# EAGLE design Kintex7_ssram (EAGLE 7.6.0)
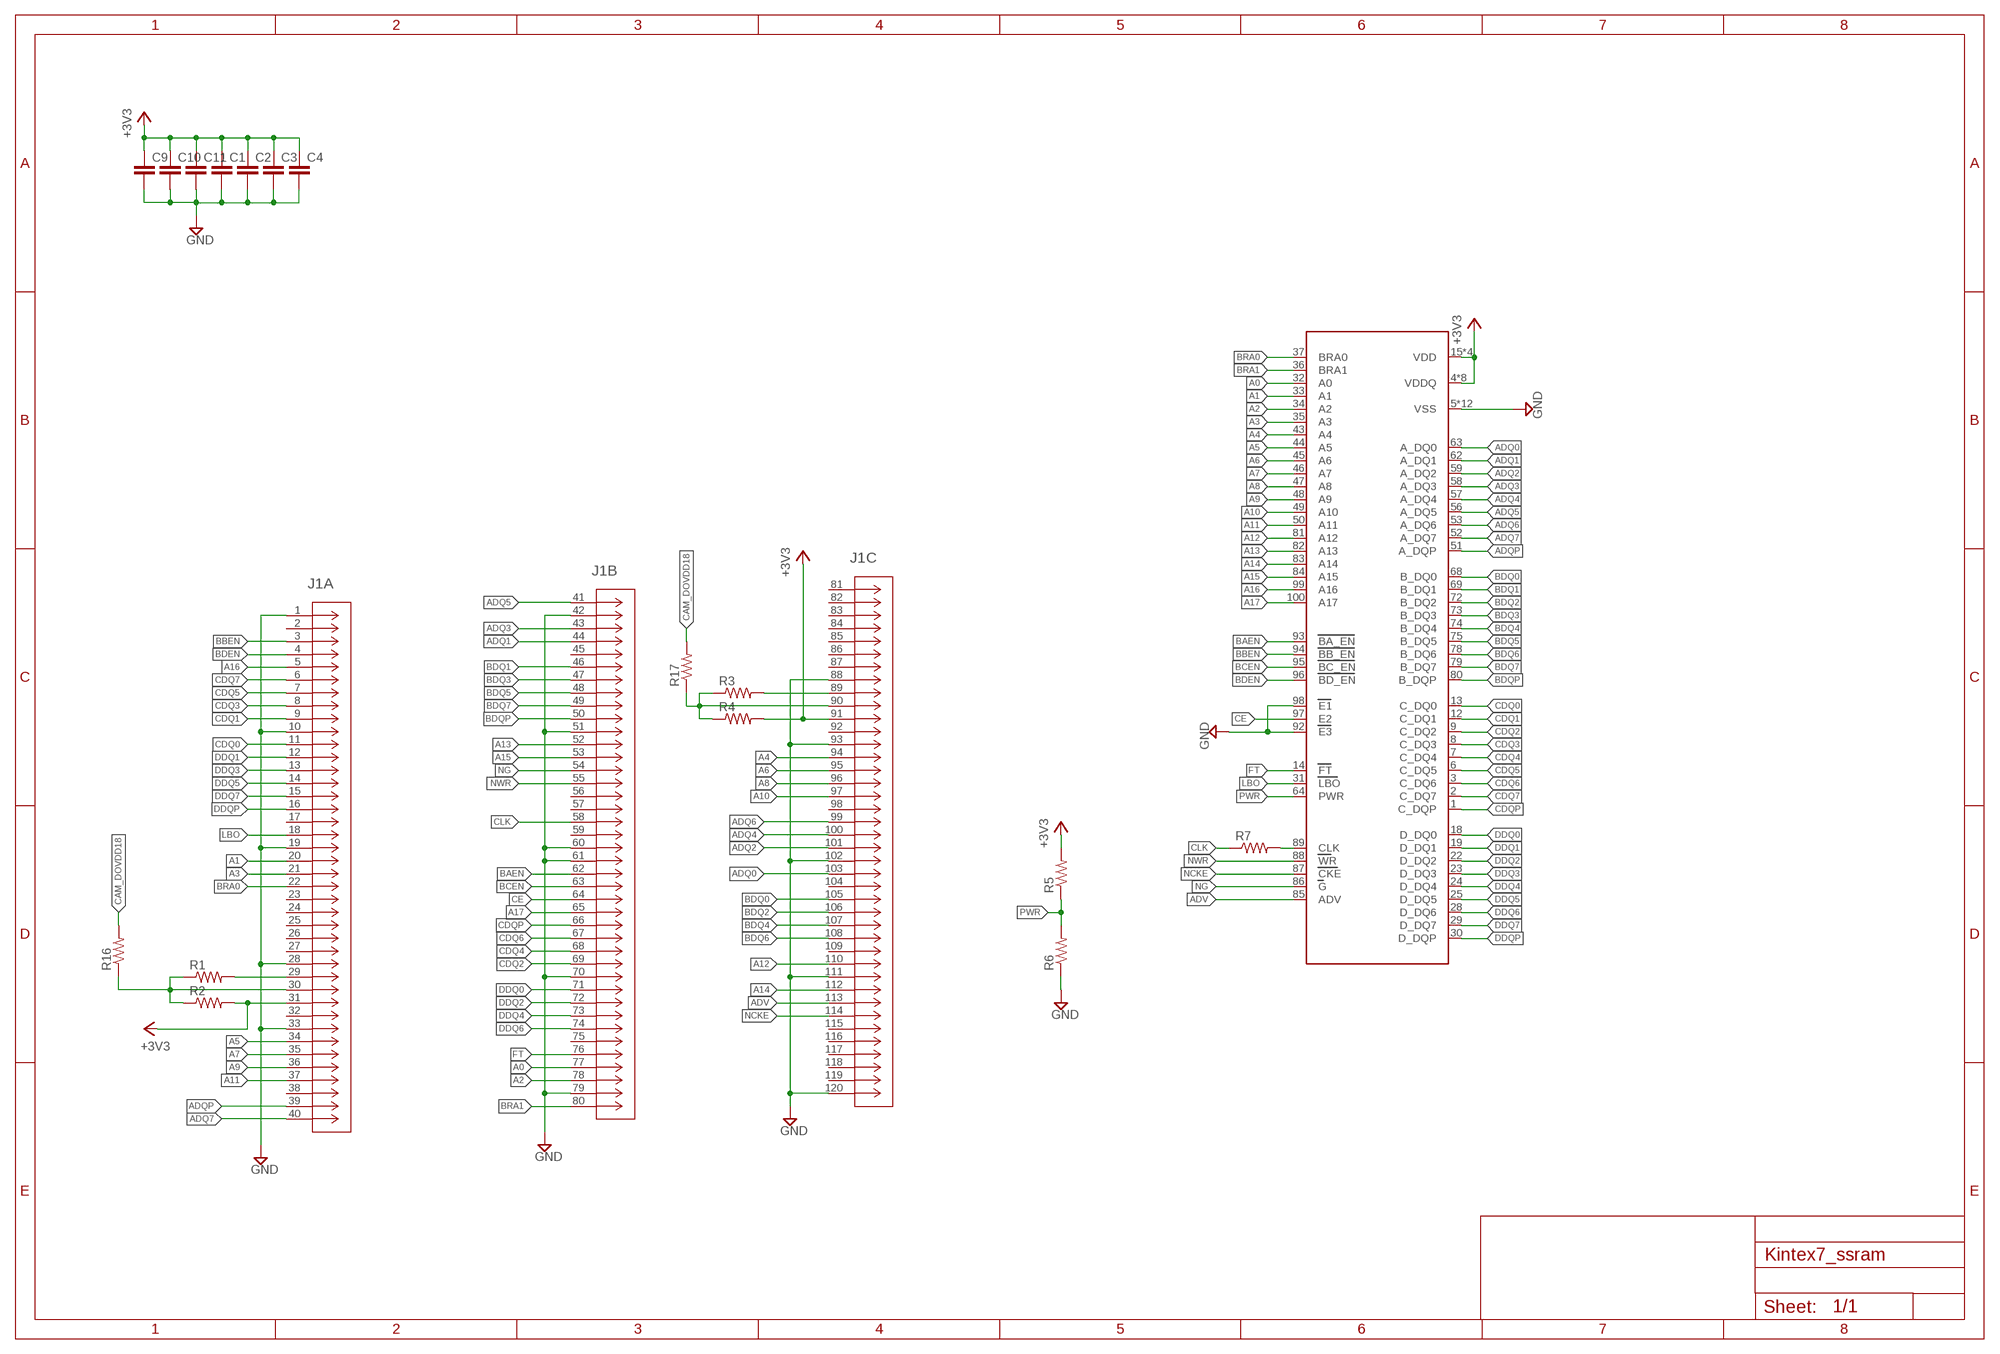
[diagram p0: schematic, sheet 1]

## Parts
C1  C-EUC0603  [C0603]
C2  C-EUC0603  [C0603]
C3  C-EUC0603  [C0603]
C4  C-EUC0603  [C0603]
C9  C-EUC0603  [C0603]
C10  C-EUC0603  [C0603]
C11  C-EUC0603  [C0603]
J1  5177985-5  [CONN_5177985-5]
R1  R-US_R0805  [R0805]
R2  R-US_R0805  [R0805]
R3  R-US_R0805  [R0805]
R4  R-US_R0805  [R0805]
R5  R-US_R0603  [R0603]
R6  R-US_R0603  [R0603]
R7  R-US_R0603  [R0603]
R16  R-US_R0805  [R0805]
R17  R-US_R0805  [R0805]
RAM  GS8320Z36GTSMT  [TQFP100-R]

## Nets
+3V3: C1.1 C2.1 C3.1 C4.1 C9.1 C10.1 C11.1 J1.31 J1.91 R2.2 R4.2 R5.2 RAM.4(VDDQ) RAM.11(VDDQ) RAM.15(VDD) RAM.20(VDDQ) RAM.27(VDDQ) RAM.41(VDD) RAM.54(VDDQ) RAM.61(VDDQ) RAM.65(VDD) RAM.70(VDDQ) RAM.77(VDDQ) RAM.91(VDD)
A0: J1.77 RAM.32(A0)
A1: J1.20 RAM.33(A1)
A2: J1.78 RAM.34(A2)
A3: J1.21 RAM.35(A3)
A4: J1.94 RAM.43(A4)
A5: J1.34 RAM.44(A5)
A6: J1.95 RAM.45(A6)
A7: J1.35 RAM.46(A7)
A8: J1.96 RAM.47(A8)
A9: J1.36 RAM.48(A9)
A10: J1.97 RAM.49(A10)
A11: J1.37 RAM.50(A11)
A12: J1.110 RAM.81(A12)
A13: J1.52 RAM.82(A13)
A14: J1.112 RAM.83(A14)
A15: J1.53 RAM.84(A15)
A16: J1.5 RAM.99(A16)
A17: J1.65 RAM.100(A17)
ADQ0: J1.103 RAM.63(A_DQ0)
ADQ1: J1.44 RAM.62(A_DQ1)
ADQ2: J1.101 RAM.59(A_DQ2)
ADQ3: J1.43 RAM.58(A_DQ3)
ADQ4: J1.100 RAM.57(A_DQ4)
ADQ5: J1.41 RAM.56(A_DQ5)
ADQ6: J1.99 RAM.53(A_DQ6)
ADQ7: J1.40 RAM.52(A_DQ7)
ADQP: J1.39 RAM.51(A_DQP)
ADV: J1.113 RAM.85(ADV)
BAEN: J1.62 RAM.93(BA_EN)
BBEN: J1.3 RAM.94(BB_EN)
BCEN: J1.63 RAM.95(BC_EN)
BDEN: J1.4 RAM.96(BD_EN)
BDQ0: J1.105 RAM.68(B_DQ0)
BDQ1: J1.46 RAM.69(B_DQ1)
BDQ2: J1.106 RAM.72(B_DQ2)
BDQ3: J1.47 RAM.73(B_DQ3)
BDQ4: J1.107 RAM.74(B_DQ4)
BDQ5: J1.48 RAM.75(B_DQ5)
BDQ6: J1.108 RAM.78(B_DQ6)
BDQ7: J1.49 RAM.79(B_DQ7)
BDQP: J1.50 RAM.80(B_DQP)
BRA0: J1.22 RAM.37(BRA0)
BRA1: J1.80 RAM.36(BRA1)
CAM_DOVDD18: R16.2 R17.2
CDQ0: J1.11 RAM.13(C_DQ0)
CDQ1: J1.9 RAM.12(C_DQ1)
CDQ2: J1.69 RAM.9(C_DQ2)
CDQ3: J1.8 RAM.8(C_DQ3)
CDQ4: J1.68 RAM.7(C_DQ4)
CDQ5: J1.7 RAM.6(C_DQ5)
CDQ6: J1.67 RAM.3(C_DQ6)
CDQ7: J1.6 RAM.2(C_DQ7)
CDQP: J1.66 RAM.1(C_DQP)
CE: J1.64 RAM.97(E2)
CLK: J1.58 R7.1
DDQ0: J1.71 RAM.18(D_DQ0)
DDQ1: J1.12 RAM.19(D_DQ1)
DDQ2: J1.72 RAM.22(D_DQ2)
DDQ3: J1.13 RAM.23(D_DQ3)
DDQ4: J1.73 RAM.24(D_DQ4)
DDQ5: J1.14 RAM.25(D_DQ5)
DDQ6: J1.74 RAM.28(D_DQ6)
DDQ7: J1.15 RAM.29(D_DQ7)
DDQP: J1.16 RAM.30(D_DQP)
FT: J1.76 RAM.14(FT)
GND: C1.2 C2.2 C3.2 C4.2 C9.2 C10.2 C11.2 J1.1 J1.10 J1.19 J1.28 J1.33 J1.42 J1.51 J1.60 J1.61 J1.70 J1.79 J1.88 J1.93 J1.102 J1.111 J1.120 R6.1 RAM.5(VSS) RAM.10(VSS) RAM.17(VSS) RAM.21(VSS) RAM.26(VSS) RAM.40(VSS) RAM.55(VSS) RAM.60(VSS) RAM.67(VSS) RAM.71(VSS) RAM.76(VSS) RAM.90(VSS) RAM.92(E3) RAM.98(E1)
LBO: J1.18 RAM.31(LBO)
N$1: R7.2 RAM.89(CLK)
N$2: J1.90 R3.1 R4.1 R17.1
N$3: J1.29 R1.2
N$4: J1.89 R3.2
N$9: J1.30 R1.1 R2.1 R16.1
NCKE: J1.114 RAM.87(CKE)
NG: J1.54 RAM.86(G)
NWR: J1.55 RAM.88(WR)
PWR: R5.1 R6.2 RAM.64(PWR)
Unconnected: J1.2 J1.17 J1.23 J1.24 J1.25 J1.26 J1.27 J1.32 J1.38 J1.45 J1.56 J1.57 J1.59 J1.75 J1.81 J1.82 J1.83 J1.84 J1.85 J1.86 J1.87 J1.92 J1.98 J1.104 J1.109 J1.115 J1.116 J1.117 J1.118 J1.119

## Library data of the parts
C1-C4 C9-C11 = resistor:C-EU: CAPACITOR, European symbol
J1 = te_con:5177985-5; BUILT_BY: EMA_UL_Team; MANUFACTURER_PART_NUMBER: 5177985-5; VENDOR: TE Connectivity
R1-R7 R16 R17 = rcl:R-US_: RESISTOR, American symbol
RAM = 2ref-packages-longpad:GS8320Z36GT

## Board
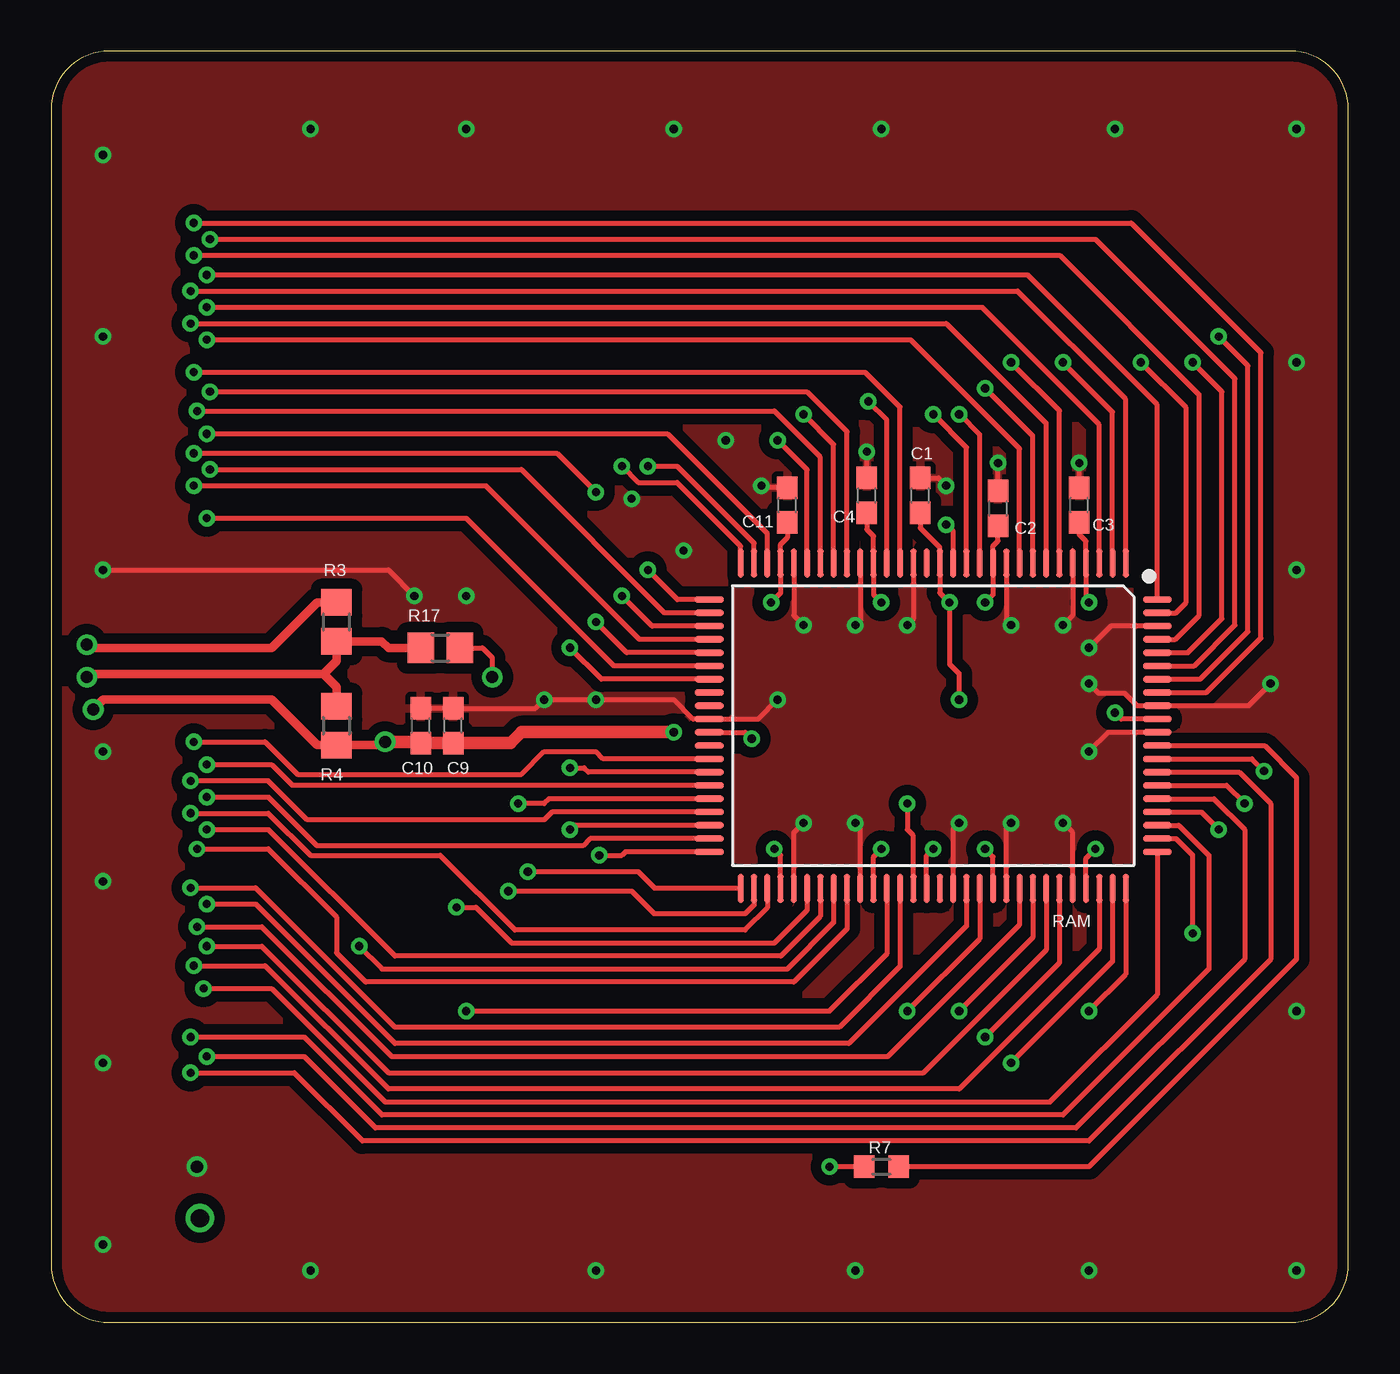
[diagram p1: board, top side]
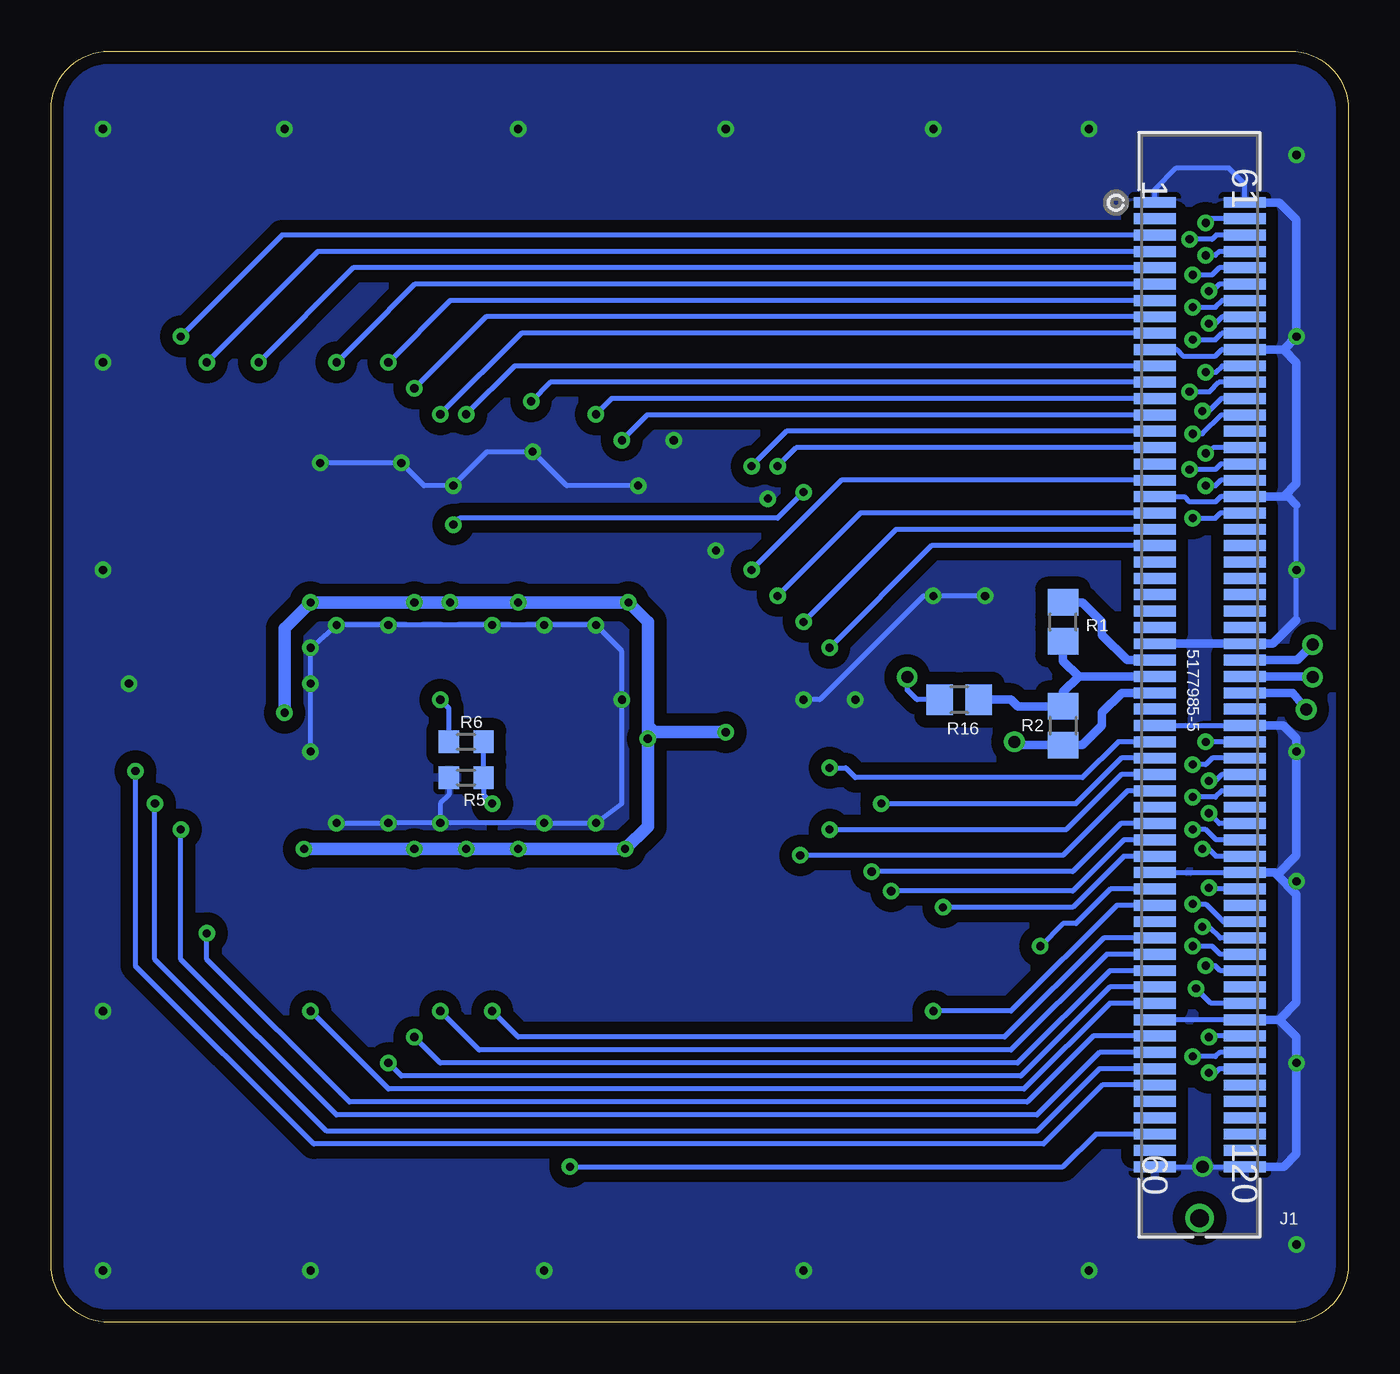
[diagram p2: board, bottom side, seen from below]

Size 63.5 x 62.23 mm. Coordinates in mm from the lower left corner, seen from the top.
Outline: 0,59.39 0,2.84 arc90 2.84,0 60.66,0 arc90 63.5,2.84 63.5,59.39 arc90 60.66,62.23 2.84,62.23 arc90 0,59.39
Copper layers (1*16): Top 0.035mm / dielectric 1.5mm / Bottom 0.035mm
Design rules "2side *": minimum track width 6mil, minimum drill 0.4mm, track to track 7mil, track to pad 7mil, pad to pad 7mil, via to via 7mil, smd to smd 7mil, copper to edge 10mil, drill to drill 10mil, minimum pad ring 10mil, minimum via ring 8mil, stop-mask expansion 1mil, vias tented up to drill 0.8mm, thermal gap 10mil

### Footprints (pad centres in the part's own frame; a part is rotated, then mirrored left to right if it is on the bottom)
C0603 = smd 1.1 x 1: 1 -0.85,0; 2 0.85,0
CONN_5177985-5 = smd 0.533 x 2.057: 1 -47.2,-4.4; 2 -46.4,-4.4; 3 -45.6,-4.4; 4 -44.8,-4.4; 5 -44,-4.4; 6 -43.2,-4.4; 7 -42.4,-4.4; 8 -41.6,-4.4; 9 -40.8,-4.4; 10 -40,-4.4; 11 -39.2,-4.4; 12 -38.4,-4.4; 13 -37.6,-4.4; 14 -36.8,-4.4; 15 -36,-4.4; 16 -35.2,-4.4; 17 -34.4,-4.4; 18 -33.6,-4.4; 19 -32.8,-4.4; 20 -32,-4.4; 21 -31.2,-4.4; 22 -30.4,-4.4; 23 -29.6,-4.4; 24 -28.8,-4.4; 25 -28,-4.4; 26 -27.2,-4.4; 27 -26.4,-4.4; 28 -25.6,-4.4; 29 -24.8,-4.4; 30 -24,-4.4; 31 -23.2,-4.4; 32 -22.4,-4.4; 33 -21.6,-4.4; 34 -20.8,-4.4; 35 -20,-4.4; 36 -19.2,-4.4; 37 -18.4,-4.4; 38 -17.6,-4.4; 39 -16.8,-4.4; 40 -16,-4.4; 41 -15.2,-4.4; 42 -14.4,-4.4; 43 -13.6,-4.4; 44 -12.8,-4.4; 45 -12,-4.4; 46 -11.2,-4.4; 47 -10.4,-4.4; 48 -9.6,-4.4; 49 -8.8,-4.4; 50 -8,-4.4; 51 -7.2,-4.4; 52 -6.4,-4.4; 53 -5.6,-4.4; 54 -4.8,-4.4; 55 -4,-4.4; 56 -3.2,-4.4; 57 -2.4,-4.4; 58 -1.6,-4.4; 59 -0.8,-4.4; 60 0,-4.4; 61 -47.2,0; 62 -46.4,0; 63 -45.6,0; 64 -44.8,0; 65 -44,0; 66 -43.2,0; 67 -42.4,0; 68 -41.6,0; 69 -40.8,0; 70 -40,0; 71 -39.2,0; 72 -38.4,0; 73 -37.6,0; 74 -36.8,0; 75 -36,0; 76 -35.2,0; 77 -34.4,0; 78 -33.6,0; 79 -32.8,0; 80 -32,0; 81 -31.2,0; 82 -30.4,0; 83 -29.6,0; 84 -28.8,0; 85 -28,0; 86 -27.2,0; 87 -26.4,0; 88 -25.6,0; 89 -24.8,0; 90 -24,0; 91 -23.2,0; 92 -22.4,0; 93 -21.6,0; 94 -20.8,0; 95 -20,0; 96 -19.2,0; 97 -18.4,0; 98 -17.6,0; 99 -16.8,0; 100 -16,0; 101 -15.2,0; 102 -14.4,0; 103 -13.6,0; 104 -12.8,0; 105 -12,0; 106 -11.2,0; 107 -10.4,0; 108 -9.6,0; 109 -8.8,0; 110 -8,0; 111 -7.2,0; 112 -6.4,0; 113 -5.6,0; 114 -4.8,0; 115 -4,0; 116 -3.2,0; 117 -2.4,0; 118 -1.6,0; 119 -0.8,0; 120 0,0 | drill 0.889 pad 0.889: 121 2.515,-2.21
R0805 = smd 1.3 x 1.5: 1 -0.95,0; 2 0.95,0
R0603 = smd 1 x 1.1: 1 -0.85,0; 2 0.85,0
TQFP100-R = smd 0.3 x 1.4: 1 -9.425,-7.963; 2 -8.775,-7.963; 3 -8.125,-7.963; 4 -7.475,-7.963; 5 -6.825,-7.963; 6 -6.175,-7.963; 7 -5.525,-7.963; 8 -4.875,-7.963; 9 -4.225,-7.963; 10 -3.575,-7.963; 11 -2.925,-7.963; 12 -2.275,-7.963; 13 -1.625,-7.963; 14 -0.975,-7.963; 15 -0.325,-7.963; 16 0.325,-7.963; 17 0.975,-7.963; 18 1.625,-7.963; 19 2.275,-7.963; 20 2.925,-7.963; 21 3.575,-7.963; 22 4.225,-7.963; 23 4.875,-7.963; 24 5.525,-7.963; 25 6.175,-7.963; 26 6.825,-7.963; 27 7.475,-7.963; 28 8.125,-7.963; 29 8.775,-7.963; 30 9.425,-7.963; 51 9.425,7.963; 52 8.775,7.963; 53 8.125,7.963; 54 7.475,7.963; 55 6.825,7.963; 56 6.175,7.963; 57 5.525,7.963; 58 4.875,7.963; 59 4.225,7.963; 60 3.575,7.963; 61 2.925,7.963; 62 2.275,7.963; 63 1.625,7.963; 64 0.975,7.963; 65 0.325,7.963; 66 -0.325,7.963; 67 -0.975,7.963; 68 -1.625,7.963; 69 -2.275,7.963; 70 -2.925,7.963; 71 -3.575,7.963; 72 -4.225,7.963; 73 -4.875,7.963; 74 -5.525,7.963; 75 -6.175,7.963; 76 -6.825,7.963; 77 -7.475,7.963; 78 -8.125,7.963; 79 -8.775,7.963; 80 -9.425,7.963 | smd 1.4 x 0.3: 31 10.963,-6.175; 32 10.963,-5.525; 33 10.963,-4.875; 34 10.963,-4.225; 35 10.963,-3.575; 36 10.963,-2.925; 37 10.963,-2.275; 38 10.963,-1.625; 39 10.963,-0.975; 40 10.963,-0.325; 41 10.963,0.325; 42 10.963,0.975; 43 10.963,1.625; 44 10.963,2.275; 45 10.963,2.925; 46 10.963,3.575; 47 10.963,4.225; 48 10.963,4.875; 49 10.963,5.525; 50 10.963,6.175; 81 -10.963,6.175; 82 -10.963,5.525; 83 -10.963,4.875; 84 -10.963,4.225; 85 -10.963,3.575; 86 -10.963,2.925; 87 -10.963,2.275; 88 -10.963,1.625; 89 -10.963,0.975; 90 -10.963,0.325; 91 -10.963,-0.325; 92 -10.963,-0.975; 93 -10.963,-1.625; 94 -10.963,-2.275; 95 -10.963,-2.925; 96 -10.963,-3.575; 97 -10.963,-4.225; 98 -10.963,-4.875; 99 -10.963,-5.525; 100 -10.963,-6.175

### Placement (x,y rotation side)
C1  42.54,40.48 90 top
C2  46.35,39.85 90 top
C3  50.32,40.01 90 top
C4  39.93,40.48 90 top
C9  19.68,29.21 90 top
C10  18.1,29.21 90 top
C11  36.04,40.01 90 top
J1  5.08,7.62 270 bottom
R1  13.97,34.29 90 bottom
R2  13.97,29.21 270 bottom
R3  13.97,34.29 90 top
R4  13.97,29.21 270 top
R5  43.18,28.42 180 bottom
R6  43.18,26.67 0 bottom
R7  40.64,7.62 0 top
R16  19.05,30.48 180 bottom
R17  19.05,33.02 0 top
RAM  43.18,29.21 180 top

### Tracks (layer width: path | path; a pad name or v marks a point on that pad's centre or on a via)
+3V3  (via drill 0.4, 0.6)
  Top 0.254: C1.1 42.54,38.89 43.5,37.93 RAM.15 43.5,35.71 v43.97,35.24 43.97,32.23 44.45,31.75 v44.45,30.48 | v45.72,35.24 46.1,35.63 RAM.11 46.1,38.01 46.35,38.26 C2.1 | v50.8,35.24 50.65,35.39 RAM.4 50.65,38.24 50.32,38.58 C3.1 | v35.24,35.24 35.7,35.7 RAM.27 35.7,38.09 36.04,38.42 C11.1 | v40.64,35.24 40.25,35.63 RAM.20 40.25,38.48 39.93,38.81 C4.1 | RAM.91 52.38,29.54 v52.07,29.84 | RAM.41 33.98,28.89 v34.29,28.57 | RAM.77 50.65,22.71 v51.12,23.18 | RAM.61 40.25,22.79 v40.64,23.18 | RAM.70 46.1,22.79 v45.72,23.18 | RAM.65 42.85,22.85 v43.18,23.18 | RAM.54 35.7,22.87 v35.4,23.18 | 18.04,28.42 C10.1
  Top 0.406: v2.06,30 2.54,30.48 10.79,30.48 13.02,28.26 R2.2 16.19,28.26 v16.35,28.42
  Top 0.61: v16.35,28.42 18.04,28.42 | C10.1 C9.1 22.49,28.36 23.02,28.89 v30.48,28.89
  Bottom 0.254: R5.2 44.03,30.06 v44.45,30.48
  Bottom 0.406: J1.91 2.72,30.82 v2.06,30 | J1.31 11.09,30.82 12.07,29.84 12.07,29.21 13.02,28.26 R2.2 16.19,28.26 v16.35,28.42
  Bottom 0.61: v52.07,29.84 52.07,33.97 v50.8,35.24 v45.72,35.24 v43.97,35.24 v40.64,35.24 v35.24,35.24 34.29,34.29 34.29,29.21 | 34.29,29.21 v34.29,28.57 34.29,24.29 v35.4,23.18 v40.64,23.18 v43.18,23.18 v45.72,23.18 v51.12,23.18 | v30.48,28.89 33.97,28.89 34.29,29.21
A0  (via drill 0.4)
  Top 0.254: RAM.32 30.04,34.73 23.02,41.75 v7.78,41.75
  Bottom 0.254: J1.77 6.24,42.02 6.51,41.75 v7.78,41.75
A1  (via drill 0.4)
  Top 0.254: RAM.33 29.41,34.09 v27.94,35.56
  Bottom 0.254: J1.20 23.88,39.62 v27.94,35.56
A2  (via drill 0.4)
  Top 0.254: RAM.34 28.8,33.44 21.27,40.96 v6.99,40.96
  Bottom 0.254: J1.78 6.25,41.22 6.51,40.96 v6.99,40.96
A3  (via drill 0.4)
  Top 0.254: RAM.35 28.18,32.78 v26.67,34.29
  Bottom 0.254: J1.21 22.14,38.82 v26.67,34.29
A4  (via drill 0.4)
  Top 0.254: v6.99,28.42 10.48,28.42 12.07,26.83 23.02,26.83 24.13,27.94 26.67,27.94 27.03,27.59 RAM.43
  Bottom 0.254: J1.94 v6.98,28.42 v6.99,28.42
A5  (via drill 0.4)
  Top 0.254: RAM.44 26.3,26.93 26.09,27.15 v25.4,27.15
  Bottom 0.254: J1.34 11.27,28.42 13.02,26.67 24.13,26.67 24.61,27.15 v25.4,27.15
A6  (via drill 0.4)
  Top 0.254: v7.62,27.3 10.79,27.3 11.82,26.29 RAM.45
  Bottom 0.254: J1.95 6.67,27.62 6.99,27.3 v7.62,27.3
A7  (via drill 0.4)
  Top 0.254: RAM.46 24.37,25.64 24.13,25.4 v22.86,25.4
  Bottom 0.254: J1.35 11.12,27.62 13.34,25.4 v22.86,25.4
A8  (via drill 0.4)
  Top 0.254: RAM.47 24.51,24.98 24.13,24.61 12.54,24.61 10.64,26.51 v6.83,26.51
  Bottom 0.254: v6.83,26.51 6.51,26.51 6.2,26.82 J1.96
A9  (via drill 0.4)
  Top 0.254: RAM.48 25.61,24.34 v25.4,24.13
  Bottom 0.254: J1.36 11.12,26.82 13.81,24.13 v25.4,24.13
A10  (via drill 0.4)
  Top 0.254: 7.94,25.72 v7.62,25.72 10.64,25.72 13.02,23.34 26.04,23.34 26.38,23.68 RAM.49
  Bottom 0.254: J1.97 6.21,26.02 6.51,25.72 v7.62,25.72
A11  (via drill 0.4)
  Top 0.254: v26.83,22.86 27.94,22.86 28.12,23.04 RAM.50
  Bottom 0.254: J1.37 10.81,26.02 13.97,22.86 v26.83,22.86
A12  (via drill 0.4)
  Top 0.254: v7.46,16.35 10.79,16.35 16.35,10.79 48.89,10.79 54.14,16.04 RAM.81
  Bottom 0.254: J1.110 6.73,15.62 v7.46,16.35
A13  (via drill 0.4)
  Top 0.254: v55.88,19.05 55.88,22.86 55.05,23.68 RAM.82
  Bottom 0.254: J1.52 12.49,14.02 15.72,10.79 48.89,10.79 55.88,17.78 v55.88,19.05
A14  (via drill 0.4)
  Top 0.254: RAM.83 55.2,24.34 56.67,22.86 56.67,17.3 49.53,10.16 16.19,10.16 12.38,13.97 v6.83,13.97
  Bottom 0.254: J1.112 6.62,14.02 v6.83,13.97
A15  (via drill 0.4)
  Top 0.254: v57.15,24.13 56.29,24.98 RAM.84
  Bottom 0.254: J1.53 12.18,13.22 15.24,10.16 49.53,10.16 57.15,17.78 v57.15,24.13
A16  (via drill 0.4)
  Top 0.254: RAM.99 55.05,34.73 55.56,35.24 55.56,44.77 v53.34,46.99
  Bottom 0.254: v53.34,46.99 48.71,51.62 J1.5
A17  (via drill 0.4)
  Top 0.254: RAM.100 54.14,44.92 47.78,51.28 v7.62,51.28
  Bottom 0.254: v7.62,51.28 6.67,51.28 6.32,51.62 J1.65
ADQ0  (via drill 0.4)
  Top 0.254: v6.83,21.27 10,21.27 16.83,14.45 38.58,14.45 41.55,17.43 RAM.63
  Bottom 0.254: J1.103 6.77,21.22 v6.83,21.27
ADQ1  (via drill 0.4)
  Top 0.254: v20.32,15.24 38.1,15.24 40.9,18.05 RAM.62
  Bottom 0.254: J1.44 11.33,20.42 16.51,15.24 v20.32,15.24
ADQ2  (via drill 0.4)
  Top 0.254: RAM.59 38.95,19.27 36.35,16.67 15.4,16.67 13.97,18.1 13.97,19.84 10.64,23.18 v7.14,23.18
  Bottom 0.254: v7.14,23.18 6.83,23.18 6.47,22.82 J1.101
ADQ3  (via drill 0.4)
  Top 0.254: RAM.58 38.3,19.57 36.04,17.3 16.19,17.3 v15.08,18.41
  Bottom 0.254: J1.43 11.64,21.22 13.34,19.53 13.97,19.53 v15.08,18.41
ADQ4  (via drill 0.4)
  Top 0.254: v7.62,24.13 10.64,24.13 16.83,17.94 35.72,17.94 37.65,19.88 RAM.57
  Bottom 0.254: J1.100 6.47,23.62 6.99,24.13 v7.62,24.13
ADQ5  (via drill 0.4)
  Top 0.254: RAM.56 37,20.18 35.4,18.57 22.54,18.57 20.8,20.32 v19.84,20.32
  Bottom 0.254: J1.41 10.99,22.82 13.49,20.32 v19.84,20.32
ADQ6  (via drill 0.4)
  Top 0.254: v6.83,24.92 10.64,24.92 12.7,22.86 19.05,22.86 22.7,19.21 33.97,19.21 35.05,20.29 RAM.53
  Bottom 0.254: J1.99 6.32,24.42 v6.83,24.92
ADQ7  (via drill 0.4)
  Top 0.254: v22.38,21.11 28.42,21.11 29.53,20 33.97,20 34.4,20.43 RAM.52
  Bottom 0.254: J1.40 10.99,23.62 13.49,21.11 v22.38,21.11
ADQP  (via drill 0.4)
  Top 0.254: v23.34,22.07 28.73,22.07 29.55,21.25 RAM.51
  Bottom 0.254: J1.39 11.14,24.42 13.49,22.07 v23.34,22.07
ADV  (via drill 0.4)
  Top 0.254: RAM.85 56.91,25.64 58.42,24.13 58.42,17.78 50.16,9.53 15.88,9.53 12.38,13.02 v7.62,13.02
  Bottom 0.254: J1.113 6.31,13.22 6.51,13.02 v7.62,13.02
BAEN  (via drill 0.4)
  Top 0.254: RAM.93 56.55,30.84 59.21,33.5 59.21,47.47 52.86,53.82 v6.99,53.82
  Bottom 0.254: J1.62 6.78,54.02 v6.99,53.82
BBEN  (via drill 0.4)
  Top 0.254: RAM.94 56.25,31.48 58.58,33.81 58.58,46.83 v57.15,48.26
  Bottom 0.254: v57.15,48.26 52.19,53.22 J1.3
BCEN  (via drill 0.4)
  Top 0.254: RAM.95 55.95,32.13 57.94,34.13 57.94,46.2 52.7,51.44 52.39,51.75 51.12,53.02 v7.78,53.02
  Bottom 0.254: J1.63 6.47,53.22 6.67,53.02 v7.78,53.02
BDEN  (via drill 0.4)
  Top 0.254: RAM.96 55.64,32.78 57.31,34.45 57.31,45.56 v55.88,46.99
  Bottom 0.254: v55.88,46.99 50.45,52.42 J1.4
BDQ0  (via drill 0.4)
  Top 0.254: v7.62,20.48 10,20.48 16.83,13.65 39.05,13.65 44.8,19.41 RAM.68
  Bottom 0.254: v7.62,20.48 6.99,20.48 6.13,19.62 J1.105
BDQ1  (via drill 0.4)
  Top 0.254: v41.91,15.24 45.45,18.79 RAM.69
  Bottom 0.254: J1.46 11.98,18.82 16.83,13.97 40.64,13.97 v41.91,15.24
BDQ2  (via drill 0.4)
  Top 0.254: v7.14,19.37 10.32,19.37 16.67,13.02 40.96,13.02 47.4,19.46 RAM.72
  Bottom 0.254: J1.106 6.28,18.82 6.83,19.37 v7.14,19.37
BDQ3  (via drill 0.4)
  Top 0.254: RAM.73 48.05,18.84 v44.45,15.24
  Bottom 0.254: J1.47 11.83,18.02 16.51,13.34 42.54,13.34 v44.45,15.24
BDQ4  (via drill 0.4)
  Top 0.254: v7.62,18.41 10.32,18.41 16.51,12.22 42.7,12.22 48.7,18.23 RAM.74
  Bottom 0.254: J1.107 6.27,18.02 6.67,18.41 v7.62,18.41
BDQ5  (via drill 0.4)
  Top 0.254: v45.72,13.97 49.35,17.61 RAM.75
  Bottom 0.254: J1.48 11.67,17.22 16.19,12.7 44.45,12.7 v45.72,13.97
BDQ6  (via drill 0.4)
  Top 0.254: RAM.78 51.3,18.29 44.45,11.43 16.51,11.43 10.48,17.46 v6.99,17.46
  Bottom 0.254: J1.108 6.27,17.22 6.51,17.46 v6.99,17.46
BDQ7  (via drill 0.4)
  Top 0.254: RAM.79 51.95,17.66 v46.99,12.7
  Bottom 0.254: J1.49 11.68,16.42 16.03,12.06 46.35,12.06 v46.99,12.7
BDQP  (via drill 0.4)
  Top 0.254: v50.8,15.24 52.6,17.05 RAM.80
  Bottom 0.254: J1.50 11.69,15.62 15.88,11.43 46.99,11.43 v50.8,15.24
BRA0  (via drill 0.4)
  Top 0.254: RAM.37 26.93,31.48 v25.4,33.02
  Bottom 0.254: J1.22 20.4,38.02 v25.4,33.02
BRA1  (via drill 0.4)
  Top 0.254: RAM.36 27.55,32.13 20.32,39.37 v7.62,39.37
  Bottom 0.254: J1.80 6.26,39.62 6.51,39.37 v7.62,39.37
CAM_DOVDD18  (via drill 0.6)
  Top 0.254: R17.2 21.11,33.02 21.59,32.54 v21.59,31.59
  Bottom 0.254: R16.2 21.11,30.48 21.59,30.96 v21.59,31.59
CDQ0  (via drill 0.4)
  Top 0.254: v43.18,44.45 44.8,42.83 RAM.13
  Bottom 0.254: J1.11 40.81,46.82 v43.18,44.45
CDQ1  (via drill 0.4)
  Top 0.254: v44.45,44.45 45.45,43.45 RAM.12
  Bottom 0.254: J1.9 40.48,48.42 v44.45,44.45
CDQ2  (via drill 0.4)
  Top 0.254: RAM.9 47.4,42.77 42.07,48.1 v7.62,48.1
  Bottom 0.254: J1.69 6.19,48.42 6.51,48.1 v7.62,48.1
CDQ3  (via drill 0.4)
  Top 0.254: v45.72,45.72 48.05,43.38 RAM.8
  Bottom 0.254: v45.72,45.72 42.22,49.22 J1.8
CDQ4  (via drill 0.4)
  Top 0.254: RAM.7 48.7,44.01 43.81,48.9 v6.83,48.9
  Bottom 0.254: J1.68 6.18,49.22 6.51,48.9 v6.83,48.9
CDQ5  (via drill 0.4)
  Top 0.254: v46.99,46.99 49.35,44.62 RAM.6
  Bottom 0.254: v46.99,46.99 43.96,50.02 J1.7
CDQ6  (via drill 0.4)
  Top 0.254: RAM.3 51.3,43.95 45.56,49.69 v7.62,49.69
  Bottom 0.254: J1.67 6.18,50.02 6.51,49.69 v7.62,49.69
CDQ7  (via drill 0.4)
  Top 0.254: v49.53,46.99 51.95,44.56 RAM.2
  Bottom 0.254: v49.53,46.99 46.99,49.53 46.97,49.55 45.7,50.82 J1.6
CDQP  (via drill 0.4)
  Top 0.254: RAM.1 52.6,45.19 47.31,50.48 v6.83,50.48
  Bottom 0.254: J1.66 6.33,50.82 6.67,50.48 v6.83,50.48
CE  (via drill 0.4)
  Top 0.254: RAM.97 55.02,33.44 56.2,34.61 56.2,45.4 49.37,52.23 v6.99,52.23
  Bottom 0.254: J1.64 6.32,52.42 6.51,52.23 v6.99,52.23
CLK  (via drill 0.4)
  Top 0.254: R7.1 v38.1,7.62
  Bottom 0.254: v38.1,7.62 13.97,7.62 12.37,9.22 J1.58
DDQ0  (via drill 0.4)
  Top 0.254: RAM.18 41.55,44.8 39.85,46.51 v6.99,46.51
  Bottom 0.254: J1.71 6.18,46.82 6.49,46.51 v6.99,46.51
DDQ1  (via drill 0.4)
  Top 0.254: v40,45.09 40.9,44.19 RAM.19
  Bottom 0.254: J1.12 39.07,46.02 v40,45.09
DDQ2  (via drill 0.4)
  Top 0.254: RAM.22 38.95,43.59 36.99,45.56 v7.78,45.56
  Bottom 0.254: J1.72 6.33,46.02 6.79,45.56 v7.78,45.56
DDQ3  (via drill 0.4)
  Top 0.254: v36.83,44.45 38.3,42.98 RAM.23
  Bottom 0.254: J1.13 36.06,45.22 v36.83,44.45
DDQ4  (via drill 0.4)
  Top 0.254: RAM.24 37.65,42.35 35.4,44.61 v7.14,44.61
  Bottom 0.254: J1.73 6.21,45.22 6.83,44.61 v7.14,44.61
DDQ5  (via drill 0.4)
  Top 0.254: RAM.25 37,41.73 v35.56,43.18
  Bottom 0.254: J1.14 34.32,44.42 v35.56,43.18
DDQ6  (via drill 0.4)
  Top 0.254: RAM.28 35.05,38.6 30.16,43.5 v7.62,43.5
  Bottom 0.254: v7.62,43.5 7.14,43.5 6.22,44.42 J1.74
DDQ7  (via drill 0.4)
  Top 0.254: RAM.29 34.4,38.14 30.64,41.91 v29.21,41.91
  Bottom 0.254: J1.15 27.5,43.62 v29.21,41.91
DDQP  (via drill 0.4)
  Top 0.254: RAM.30 33.75,38 30.64,41.12 28.73,41.12 v27.94,41.91
  Bottom 0.254: v27.94,41.91 27.03,42.82 J1.16
FT  (via drill 0.4)
  Top 0.254: v26.67,40.64 24.77,42.55 v6.99,42.55 | RAM.14 44.15,38.71 v43.81,39.05
  Bottom 0.254: J1.76 6.62,42.82 v6.99,42.55 | v26.67,40.64 27.94,39.37 43.5,39.37 v43.81,39.05
GND  (via drill 0.4, 0.6)
  Top 0.254: RAM.17 42.2,34.43 v41.91,34.13 | RAM.21 39.6,34.37 v39.37,34.13 | RAM.26 36.35,34.61 v36.83,34.13 | RAM.10 46.75,34.37 v46.99,34.13 | RAM.98 51.86,34.09 v50.8,33.02 | RAM.5 50,34.61 v49.53,34.13 | RAM.55 36.35,23.97 v36.83,24.45 | C1.2 43.44,41.33 v43.81,40.96 | C3.2 v50.32,42.07 | RAM.90 51.74,28.89 v50.8,27.94 | v50.8,31.27 51.28,30.8 52.55,30.8 53.16,30.18 RAM.92 58.6,30.18 v59.69,31.27 | RAM.60 39.6,24.21 v39.37,24.45 | RAM.67 44.15,24.15 v44.45,24.45 | RAM.71 46.75,24.21 v46.99,24.45 | RAM.76 50,23.97 v49.53,24.45 | C2.2 v46.35,42.07 | C4.2 v39.93,42.62 | C11.2 34.87,40.85 v34.77,40.96 | v2.54,36.83 16.51,36.83 v17.78,35.56 | C10.2 C9.2 23.71,30.06 v24.13,30.48 v26.67,30.48 30.48,30.48 31.43,29.54 RAM.40 34.61,29.54 v35.56,30.48
  Bottom 0.254: J1.60 v7.14,7.62 | v7.14,7.62 | J1.61 5.08,55.72 5.87,56.52 8.41,56.52 9.48,55.45 J1.1 | J1.10 8.41,47.62 8.1,47.31 6.51,47.31 6.19,47.62 J1.70 | J1.19 8.04,40.42 7.78,40.16 6.51,40.16 6.25,40.42 J1.79 | J1.33 J1.93 | J1.42 J1.102 | v50.8,27.94 v50.8,31.27 v50.8,33.02 v49.53,34.13 v46.99,34.13 v41.91,34.13 v39.37,34.13 v36.83,34.13 35.56,32.86 v35.56,30.48 35.56,25.4 v36.83,24.45 v39.37,24.45 v44.45,24.45 | v44.45,24.45 v46.99,24.45 v49.53,24.45 | v50.32,42.07 v46.35,42.07 45.24,40.96 v43.81,40.96 42.15,42.62 v39.93,42.62 38.26,40.96 v34.77,40.96 | R6.1 44.03,25.82 44.45,25.4 v44.45,24.45 | J1.111 J1.51 | 2.54,34.37 v2.54,36.83 2.54,40.01 | v17.78,35.56 20.8,35.56 25.88,30.48 v26.67,30.48 | v7.14,7.62 J1.120
  Bottom 0.406: 3.39,14.82 2.54,13.97 2.54,8.26 3.18,7.62 J1.120 | J1.102 3.6,22.02 3.49,21.91 | 3.49,21.91 2.54,20.95 2.54,15.67 3.39,14.82 | J1.28 J1.88 3.69,33.22 2.54,34.37 | 3.49,21.91 2.54,22.86 2.54,28.57 3.19,29.22 J1.93 | J1.79 3.18,40.42 | 3.18,40.42 2.95,40.42 2.54,40.01 | J1.70 3.17,47.62 | 3.17,47.62 2.54,46.99 2.54,41.05 3.18,40.42 | J1.61 3.39,54.82 2.54,53.98 v2.54,48.25 3.17,47.62 | J1.111 3.39,14.82
  other vias: 28.42,40.32 30.96,37.78 33.02,43.18 12.7,2.54 26.67,2.54 39.37,2.54 50.8,2.54 60.96,36.83 60.96,46.99 60.96,58.42 52.07,58.42 40.64,58.42 30.48,58.42 20.32,58.42 12.7,58.42 2.54,57.15 2.54,27.94 2.54,21.59 2.54,12.7 2.54,3.81 20.32,35.56 60.96,15.24 60.96,2.54
  pour Bottom (isolate 0.61): 0,62.23 63.5,62.23 63.5,0 0,0
  pour Top (isolate 0.508): 0,62.23 63.5,62.23 63.5,0 0,0
LBO  (via drill 0.4)
  Top 0.254: RAM.31 30.66,35.38 v29.21,36.83
  Bottom 0.254: J1.18 24.82,41.22 v29.21,36.83
N$1
  Top 0.254: RAM.89 59.39,28.23 60.96,26.67 60.96,17.78 50.8,7.62 R7.2
N$2  (via drill 0.6)
  Top 0.406: 13.34,31.75 13.97,32.38 R3.1 16.19,33.34 16.51,33.02 R17.1 | R4.1 13.97,31.11 13.34,31.75 | 13.34,31.75 1.9,31.75 v1.75,31.59
  Bottom 0.406: J1.90 1.77,31.62 v1.75,31.59
N$3
  Bottom 0.406: J1.29 10.83,32.42 12.07,33.66 12.07,34.29 13.02,35.24 R1.2
N$4  (via drill 0.6)
  Top 0.406: R3.2 13.02,35.24 10.79,33.02 1.9,33.02 v1.75,33.18
  Bottom 0.406: J1.89 2.5,32.42 v1.75,33.18
N$9
  Bottom 0.406: J1.30 13.21,31.62 | 13.21,31.62 13.97,32.38 R1.1 | 13.21,31.62 13.97,30.86 R2.1 16.19,30.16 16.51,30.48 R16.1
NCKE  (via drill 0.4)
  Top 0.254: RAM.87 58.15,26.93 59.69,25.4 59.69,17.78 50.8,8.89 15.24,8.89 11.91,12.22 v6.83,12.22
  Bottom 0.254: J1.114 6.31,12.42 6.51,12.22 v6.83,12.22
NG  (via drill 0.4)
  Top 0.254: v58.42,25.4 57.53,26.29 RAM.86
  Bottom 0.254: J1.54 12.19,12.42 15.24,9.37 50.01,9.37 58.42,17.78 v58.42,25.4
NWR  (via drill 0.4)
  Top 0.254: RAM.88 58.77,27.59 v59.37,26.99
  Bottom 0.254: J1.55 12.03,11.62 14.92,8.73 50.64,8.73 59.37,17.46 v59.37,26.99
PWR  (via drill 0.4)
  Top 0.254: v41.91,25.4 41.91,24.13 42.2,23.84 RAM.64
  Bottom 0.254: v41.91,25.4 42.33,25.82 R6.2 R5.1